# Altium schematic sheet Upper_Board.SchDoc
size A3
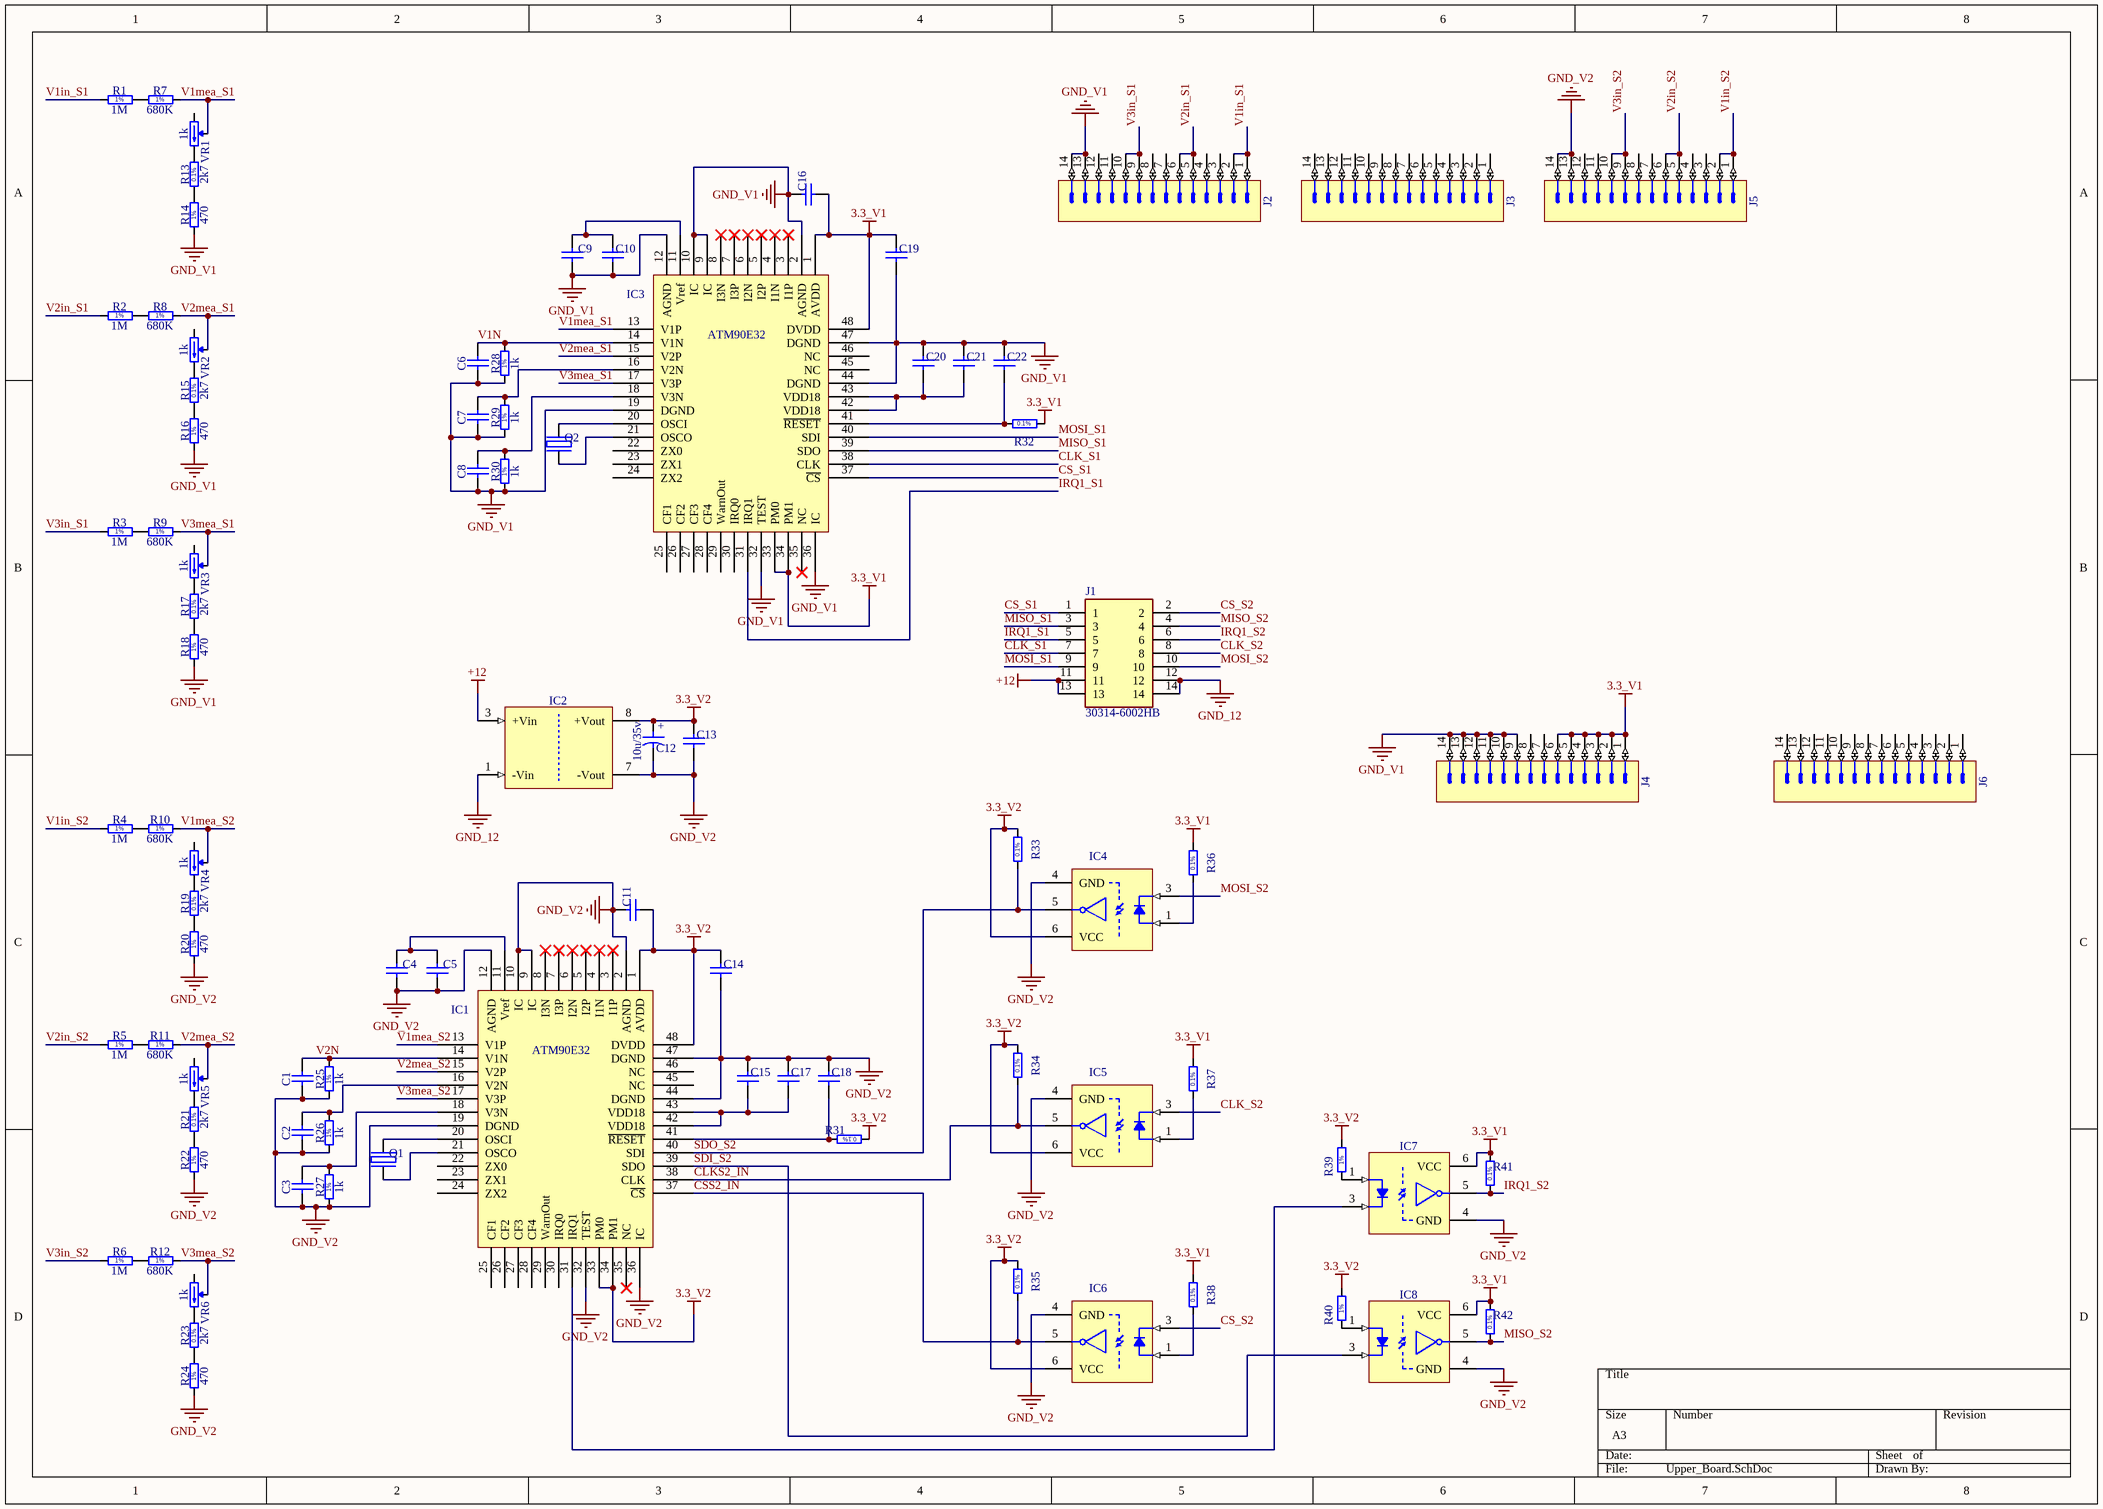
[diagram p0: Upper_Board.SchDoc]

## Parts
C1  18nf  [CAPC2012X135N]  (value not drawn)
C2  18nf  [CAPC2012X135N]  (value not drawn)
C3  18nf  [CAPC2012X135N]  (value not drawn)
C4  0.1uf  [CAPC2012X135N]  (value not drawn)
C5  4.7uf  [CAPC2012X135N]  (value not drawn)
C6  18nf  [CAPC2012X135N]  (value not drawn)
C7  18nf  [CAPC2012X135N]  (value not drawn)
C8  18nf  [CAPC2012X135N]  (value not drawn)
C9  0.1uf  [CAPC2012X135N]  (value not drawn)
C10  4.7uf  [CAPC2012X135N]  (value not drawn)
C11  0.1uf  [CAPC2012X135N]  (value not drawn)
C12  10u/35v  [CAPAE530X540N]
C13  0.1uf  [CAPC2012X135N]  (value not drawn)
C14  0.1uf  [CAPC2012X135N]  (value not drawn)
C15  0.1uf  [CAPC2012X135N]  (value not drawn)
C16  0.1uf  [CAPC2012X135N]  (value not drawn)
C17  10uf  [CAPC2012X135N]  (value not drawn)
C18  0.1uf  [CAPC2012X135N]  (value not drawn)
C19  0.1uf  [CAPC2012X135N]  (value not drawn)
C20  0.1uf  [CAPC2012X135N]  (value not drawn)
C21  10uf  [CAPC2012X135N]  (value not drawn)
C22  0.1uf  [CAPC2012X135N]  (value not drawn)
IC1  ATM90E32  [LQFP48_N]
IC2  TES 1-0511  [DCDC_TRACO_TES1-XX1X]  (value not drawn)
IC3  ATM90E32  [LQFP48_N]
IC4  ACPL-W60L-000E  [SOIC127P1150X360-6N]  (value not drawn)
IC5  ACPL-W60L-000E  [SOIC127P1150X360-6N]  (value not drawn)
IC6  ACPL-W60L-000E  [SOIC127P1150X360-6N]  (value not drawn)
IC7  ACPL-W60L-000E  [SOIC127P1150X360-6N]  (value not drawn)
IC8  ACPL-W60L-000E  [SOIC127P1150X360-6N]  (value not drawn)
J1  30314-6002HB  [SHDR14W64P254_2X7_2540X878X955P]
J2  Header 14  [STELVIO-KONTEK_3910401114400]  (value not drawn)
J3  Header 14  [STELVIO-KONTEK_3910401114400]  (value not drawn)
J4  Header 14  [STELVIO-KONTEK_3910401114400]  (value not drawn)
J5  Header 14  [STELVIO-KONTEK_3910401114400]  (value not drawn)
J6  Header 14  [STELVIO-KONTEK_3910401114400]  (value not drawn)
Q1  16.384Mhz  [XTAL1160X490X430]  (value not drawn)
Q2  16.384Mhz  [XTAL1160X490X430]  (value not drawn)
R1  1M  [RES1016-630X250]
R2  1M  [RES1016-630X250]
R3  1M  [RES1016-630X250]
R4  1M  [RES1016-630X250]
R5  1M  [RES1016-630X250]
R6  1M  [RES1016-630X250]
R7  680K  [RES1016-630X250]
R8  680K  [RES1016-630X250]
R9  680K  [RES1016-630X250]
R10  680K  [RES1016-630X250]
R11  680K  [RES1016-630X250]
R12  680K  [RES1016-630X250]
R13  2k7  [RESC2012X60N]
R14  470  [RESC2012X60N]
R15  2k7  [RESC2012X60N]
R16  470  [RESC2012X60N]
R17  2k7  [RESC2012X60N]
R18  470  [RESC2012X60N]
R19  2k7  [RESC2012X60N]
R20  470  [RESC2012X60N]
R21  2k7  [RESC2012X60N]
R22  470  [RESC2012X60N]
R23  2k7  [RESC2012X60N]
R24  470  [RESC2012X60N]
R25  1k  [RESC2012X60N]
R26  1k  [RESC2012X60N]
R27  1k  [RESC2012X60N]
R28  1k  [RESC2012X60N]
R29  1k  [RESC2012X60N]
R30  1k  [RESC2012X60N]
R31  10k  [RESC2012X60N]  (value not drawn)
R32  10k  [RESC2012X60N]  (value not drawn)
R33  10k  [RESC2012X60N]  (value not drawn)
R34  10k  [RESC2012X60N]  (value not drawn)
R35  10k  [RESC2012X60N]  (value not drawn)
R36  330  [RESC2012X60N]  (value not drawn)
R37  330  [RESC2012X60N]  (value not drawn)
R38  330  [RESC2012X60N]  (value not drawn)
R39  330  [RESC2012X60N]  (value not drawn)
R40  330  [RESC2012X60N]  (value not drawn)
R41  10k  [RESC2012X60N]  (value not drawn)
R42  10k  [RESC2012X60N]  (value not drawn)
VR1  1k  [VR5]
VR2  1k  [VR5]
VR3  1k  [VR5]
VR4  1k  [VR5]
VR5  1k  [VR5]
VR6  1k  [VR5]

## Nets
3.3_V1: C16.2 C19.1 IC3.1(AVDD) IC3.33(PM0) IC3.34(PM1) IC3.48(DVDD) IC7.6(VCC) IC8.6(VCC) J4.1 J4.2 J4.3 J4.4 J4.5 J4.6 R32.2 R36.2 R37.2 R38.2 R41.2 R42.2
3.3_V2: C11.2 C12.1 C13.1 C14.1 IC1.1(AVDD) IC1.33(PM0) IC1.34(PM1) IC1.48(DVDD) IC2.8(+Vout) IC4.6(VCC) IC5.6(VCC) IC6.6(VCC) R31.1 R33.2 R34.2 R35.2 R39.2 R40.2
+12: IC2.3(+Vin) J1.11 J1.13
GND_12: IC2.1(-Vin) J1.12 J1.14
GND_V1: C6.1 C7.1 C8.1 C9.2 C10.1 C16.1 C19.2 C20.1 C21.2 C22.1 IC3.2(AGND) IC3.9(IC) IC3.10(IC) IC3.12(AGND) IC3.19(DGND) IC3.32(TEST) IC3.36(IC) IC3.44(DGND) IC3.47(DGND) J2.13 J2.14 J4.9 J4.10 J4.11 J4.12 J4.13 J4.14 R14.1 R16.1 R18.1 R28.1 R29.1 R30.1
GND_V2: C1.1 C2.1 C3.1 C4.2 C5.1 C11.1 C12.2 C13.2 C14.2 C15.1 C17.2 C18.1 IC1.2(AGND) IC1.9(IC) IC1.10(IC) IC1.12(AGND) IC1.19(DGND) IC1.32(TEST) IC1.36(IC) IC1.44(DGND) IC1.47(DGND) IC2.7(-Vout) IC4.4(GND) IC5.4(GND) IC6.4(GND) IC7.4(GND) IC8.4(GND) J5.13 J5.14 R20.1 R22.1 R24.1 R25.1 R26.1 R27.1
CLK_S1: IC3.38(CLK) J1.7
CLK_S2: IC5.3(K) J1.8
CLKS2_IN: IC1.38(CLK) IC5.5(VO) R34.1
CS_S1: IC3.37(~{CS}) J1.1
CS_S2: IC6.3(K) J1.2
CSS2_IN: IC1.37(~{CS}) IC6.5(VO) R35.1
IRQ1_S1: IC3.31(IRQ1) J1.5
IRQ1_S2: IC7.5(VO) J1.6 R41.1
MISO_S1: IC3.39(SDO) J1.3
MISO_S2: IC8.5(VO) J1.4 R42.1
MOSI_S1: IC3.40(SDI) J1.9
MOSI_S2: IC4.3(K) J1.10
SDI_S2: IC1.39(SDO) IC8.3(K)
SDO_S2: IC1.40(SDI) IC4.5(VO) R33.1
V1in_S1: J2.1 J2.2 R1.1
V1in_S2: J5.1 J5.2 R4.1
V1mea_S1: IC3.13(V1P) R7.2 VR1.2(W)
V1mea_S2: IC1.13(V1P) R10.2 VR4.2(W)
V1N: C6.2 IC3.14(V1N) R28.2
V2in_S1: J2.5 J2.6 R2.1
V2in_S2: J5.5 J5.6 R5.1
V2mea_S1: IC3.15(V2P) R8.2 VR2.2(W)
V2mea_S2: IC1.15(V2P) R11.2 VR5.2(W)
V2N: C1.2 IC1.14(V1N) R25.2
V3in_S1: J2.9 J2.10 R3.1
V3in_S2: J5.9 J5.10 R6.1
V3mea_S1: IC3.17(V3P) R9.2 VR3.2(W)
V3mea_S2: IC1.17(V3P) R12.2 VR6.2(W)
NetC2_2: C2.2 IC1.16(V2N) R26.2
NetC3_2: C3.2 IC1.18(V3N) R27.2
NetC4_1: C4.1 C5.2 IC1.11(Vref)
NetC7_2: C7.2 IC3.16(V2N) R29.2
NetC8_2: C8.2 IC3.18(V3N) R30.2
NetC9_1: C9.1 C10.2 IC3.11(Vref)
NetC15_2: C15.2 C17.1 IC1.42(VDD18) IC1.43(VDD18)
NetC18_2: C18.2 IC1.41(~{RESET}) R31.2
NetC20_2: C20.2 C21.1 IC3.42(VDD18) IC3.43(VDD18)
NetC22_2: C22.2 IC3.41(~{RESET}) R32.1
NetIC1_20: IC1.20(OSCI) Q1.1(OSC1)
NetIC1_21: IC1.21(OSCO) Q1.2(OSC2)
NetIC1_31: IC1.31(IRQ1) IC7.3(K)
NetIC3_20: IC3.20(OSCI) Q2.1(OSC1)
NetIC3_21: IC3.21(OSCO) Q2.2(OSC2)
NetIC4_1: IC4.1(A) R36.1
NetIC5_1: IC5.1(A) R37.1
NetIC6_1: IC6.1(A) R38.1
NetIC7_1: IC7.1(A) R39.1
NetIC8_1: IC8.1(A) R40.1
NetR1_2: R1.2 R7.1
NetR2_2: R2.2 R8.1
NetR3_2: R3.2 R9.1
NetR4_2: R4.2 R10.1
NetR5_2: R5.2 R11.1
NetR6_2: R6.2 R12.1
NetR13_1: R13.1 R14.2
NetR13_2: R13.2 VR1.3(CW)
NetR15_1: R15.1 R16.2
NetR15_2: R15.2 VR2.3(CW)
NetR17_1: R17.1 R18.2
NetR17_2: R17.2 VR3.3(CW)
NetR19_1: R19.1 R20.2
NetR19_2: R19.2 VR4.3(CW)
NetR21_1: R21.1 R22.2
NetR21_2: R21.2 VR5.3(CW)
NetR23_1: R23.1 R24.2
NetR23_2: R23.2 VR6.3(CW)

Not connected (* = marked no-connect by the designer): IC1 3(I1P)* 4(I1N)* 5(I2P)* 6(I2N)* 7(I3P)* 8(I3N)* 22(ZX0) 23(ZX1) 24(ZX2) 25(CF1) 26(CF2) 27(CF3) 28(CF4) 29(WarnOut) 30(IRQ0) 35(NC)* 45(NC) 46(NC); IC3 3(I1P)* 4(I1N)* 5(I2P)* 6(I2N)* 7(I3P)* 8(I3N)* 22(ZX0) 23(ZX1) 24(ZX2) 25(CF1) 26(CF2) 27(CF3) 28(CF4) 29(WarnOut) 30(IRQ0) 35(NC)* 45(NC) 46(NC); J2 3 4 7 8 11 12; J3 1 2 3 4 5 6 7 8 9 10 11 12 13 14; J4 7 8; J5 3 4 7 8 11 12; J6 1 2 3 4 5 6 7 8 9 10 11 12 13 14; VR1 1(CCW); VR2 1(CCW); VR3 1(CCW); VR4 1(CCW); VR5 1(CCW); VR6 1(CCW)

## Notes on the sheet
- (in symbol CAE530-540_10UF_35V_20%) +
- (in symbol R0805_1K_1%_0.125W_100PPM) 1%
- (in symbol R0805_2K7_0.1%_0.125W_25PPM) 0.1%
- (in symbol R0805_10K_0.1%_0.1W_10PPM) 0.1%
- (in symbol R0805_330R_1%_0.125W_100PPM) 1%
- (in symbol R0805_470R_1%_0.125W_100PPM) 1%
- (in symbol RMF_1M_1%_0.6W_50PPM_1016-630X250) 1%
- (in symbol RMF_680K_1%_0.6W_50PPM_1016-630X250) 1%

## Library data of the parts
C1-C3 C6-C8 = CC0805_18NF_50V_10%_X7R: 0328-0120-2; Part Description: SMD Multilayer Chip Ceramic Capacitor; Manufacturer: GENERIC; Manufacturer1 Part Number: 223858615639; Voltage: 50V; TC: X7R; Tolerance: ±10%; Table: Capacitors SMD; Part Number: CC0805_18NF_50V_10%_X7R; Component Kind: Standard; Component Type: Standard; Pin Count: 2; Value: 18nF; Status: Preferred; Manufacturer Part Number: CC0805_18NF_50V_10%_X7R; Case: 0805; Mounted: Yes; Socket: No; SMD: Yes; Manufacturer1 Example: PHYCOMP; Manufacturer1 ComponentHeight: 1.35mm; HelpURL: \\cern.ch\dfs\Applications\Altium\Datasheets\CC0805_X7R_PHYCOMP.pdf; Author: CERN DEM JLC; CreateDate: 3/12/2550; LatestRevisionDate: 3/12/2550
C4 C9 C11 C13-C16 C18-C20 C22 = CC0805_100NF_50V_10%_X7R: 0092-0004-8; Part Description: SMD Multilayer Chip Ceramic Capacitor; Manufacturer: GENERIC; Manufacturer1 Part Number: B37941K5104K62; Value: 100nF; Voltage: 50V; TC: X7R; Tolerance: ±10%; Table: Capacitors SMD; Part Number: CC0805_100NF_50V_10%_X7R; Component Kind: Standard; Component Type: Standard; Pin Count: 2; Status: Preferred; Manufacturer Part Number: CC0805_100NF_50V_10%_X7R; Case: 0805; Mounted: Yes; Socket: No; SMD: Yes; Manufacturer1 Example: EPCOS; Manufacturer1 ComponentHeight: 1.35mm; HelpURL: \\cern.ch\dfs\Applications\Altium\Datasheets\CC0805_X7R_EPCOS.pdf; Author: CERN DEM JLC; CreateDate: 3/12/2550; LatestRevisionDate: 3/12/2550
C5 C10 = CC0805_4.7UF_10V_10%_X5R: 0160-0457-5; Part Description: SMD Multilayer Chip Ceramic Capacitor; Manufacturer: GENERIC; Manufacturer1 Part Number: 222224013672; Voltage: 10V; TC: X5R; Tolerance: ±10%; Table: Capacitors SMD; Part Number: CC0805_4.7UF_10V_10%_X5R; Component Kind: Standard; Component Type: Standard; Pin Count: 2; Value: 4.7uF; Status: Preferred; Manufacturer Part Number: CC0805_4.7UF_10V_10%_X5R; Case: 0805; Mounted: Yes; Socket: No; SMD: Yes; Manufacturer1 Example: PHYCOMP; Manufacturer1 ComponentHeight: 1.45mm; HelpURL: \\cern.ch\dfs\Applications\Altium\Datasheets\CC0805_X5R_PHYCOMP_HC.pdf; Author: CERN DEM JLC; CreateDate: 3/12/2550; LatestRevisionDate: 3/12/2550
C12 = CAE530-540_10UF_35V_20%: 0289-0032-3; Part Description: Aluminum Electrolytic SMT Capacitor; Manufacturer: GENERIC; Manufacturer1 Part Number: EEEFK1V100AR; Value: 10uF; Voltage: 35V; Tolerance: ±20%; Table: Capacitors SMD; Part Number: CAE530-540_10UF_35V_20%; Component Kind: Standard; Component Type: Standard; Pin Count: 2; Status: Not Recommended; Manufacturer Part Number: CAE530-540_10UF_35V_20%; Case: C; Mounted: Yes; Socket: No; SMD: Yes; Manufacturer1 Example: PANASONIC; Manufacturer1 ComponentHeight: 5.8mm; HelpURL: \\cern.ch\dfs\Applications\Altium\Datasheets\CAE_PANASONIC_FK.pdf; Author: CERN DEM JLC; CreateDate: 3/12/2550; LatestRevisionDate: 3/12/2550
C17 C21 = CC0805_10UF_10V_10%_X7R: 0328-0108-8; Part Description: SMD Multilayer Chip Ceramic Capacitor; Manufacturer: GENERIC; Manufacturer1 Part Number: GRM21BR71A106KE51L; Voltage: 10V; TC: X7R; Tolerance: ±10%; Table: Capacitors SMD; Part Number: CC0805_10UF_10V_10%_X7R; Component Kind: Standard; Component Type: Standard; Pin Count: 2; Value: 10uF; Status: Preferred; Manufacturer Part Number: CC0805_10UF_10V_10%_X7R; Case: 0805; Mounted: Yes; Socket: No; SMD: Yes; Manufacturer1 Example: MURATA; Manufacturer1 ComponentHeight: 1.35mm; HelpURL: \\cern.ch\dfs\Applications\Altium\Datasheets\CC0805_X7R_MURATA.pdf; Author: CERN DEM JLC; CreateDate: 30/4/2555; LatestRevisionDate: 30/4/2555
IC2 = TES 1-0511: 0658-0041-5 DC-DC Converter 3.3VDC/30mA-303mA,1W, / Isolated and Unregulated Single Output, / Fixed Input Voltage 12VDC; Part Description: 5V ±10% to 5V, Iout (max) 200mA, 1W DC-DC Converter; Manufacturer: TRACO POWER; Table: DC-DC Converters; Part Number: TES 1-0511; Component Kind: Standard; Component Type: Standard; Device: TES 1-0511; PackageDescription: TES 1 Series, Single Output DC/DC Converter,  Body 13.7x8mm; Manufacturer Part Number: TES 1-0511; Pin Count: 5; Mounted: Yes; Socket: No; SMD: Yes; ComponentHeight: 7.25mm; HelpURL: \\cern.ch\dfs\Applications\Altium\Datasheets\TES 1-0511.pdf; Author: CERN DEM JMW; CreateDate: 13/1/2554; LatestRevisionDate: 13/1/2554
IC4-IC8 = ACPL-W60L-000E: 0087-0267-8; Part Description: High Speed LVTTL Compatible 3.3Volt/5Volt Optocoupler; Manufacturer: AVAGO TECHNOLOGIES; Table: Optocouplers; Part Number: ACPL-W60L-000E; Component Kind: Standard; Component Type: Standard; Device: ACPL-W60L-000E; PackageDescription: SOIC, 1.27mm Pitch; 6 Pin, 6.90mm W X 4.70mm L X 3.60mm H Body, IPC Medium Density; Manufacturer Part Number: ACPL-W60L-000E; Pin Count: 6; Case: SOIC6; Mounted: Yes; Socket: No; SMD: Yes; ComponentHeight: 3.6mm; HelpURL: \\cern.ch\dfs\Applications\Altium\Datasheets\ACPL-W60L-000E.pdf; Author: CERN DEM JMW; CreateDate: 26/2/2557; LatestRevisionDate: 26/2/2557
J1 = 30314-6002HB: Connector; Manufacturer_Name: 3M; Datasheet Link: https://componentsearchengine.com/Datasheets/2/30314-6002HB.pdf; Height: 9.554mm; Manufacturer_Part_Number: 30314-6002HB
J2-J6 = STELVIO-KONTEK_3910401114400: Connector 14 Male; Part Description: 14 Contacts - Pitch 2.54mm - Dual Row Right Angle Strip Header - Insulator 1.7mm; Table: STELVIO-KONTEK COMATEL; Part Number: STELVIO-KONTEK_3910401114400; Component Kind: Standard; Component Type: Standard; Pin Count: 14; Family: Header 14; Mounted: Yes; Socket: No; SMD: No; Status: None; Manufacturer: STELVIO-KONTEK; Manufacturer Part Number: 3910401114400; ComponentHeight: 5.7mm; HelpURL: \\cern.ch\dfs\Applications\Altium\Datasheets\STELVIO-KONTEK_3910401114400.pdf; Author: CERN DEM JLC; CreateDate: 29/8/2556; LatestRevisionDate: 29/8/2556
Q1 Q2 = XTAL_6MHZ_RAKON_HC49/4H SMX_20/50/10/16: 0099-0185-7; Part Description: Tolerance:± 20ppm, Stability:± 50ppm, -10°C to +70°C, 16pF, Surface Mount Quartz Crystal, HC49/4HSMX Serie; Manufacturer: RAKON; Manufacturer Part Number: 6MHz HC49/4H SMX 20/50/10/16; Value: 6MHz; Table: Crystals & Oscillators; Part Number: XTAL_6MHZ_RAKON_HC49/4H SMX_20/50/10/16; Component Kind: Standard; Component Type: Standard; PackageDescription: HC49/4H SMX Case, SMD Cristal, Body 11.6x4.9mm; Pin Count: 2; Mounted: Yes; Socket: No; SMD: Yes; ComponentHeight: 4.3mm; HelpURL: \\cern.ch\dfs\Applications\Altium\Datasheets\XTAL_RAKON_HC49-4HSMX.pdf; Author: CERN DEM JMW; CreateDate: 7/10/2551; LatestRevisionDate: 3/6/2553
R1-R6 = RMF_1M_1%_0.6W_50PPM_1016-630X250: 0150-2831-6; Part Description: Leaded Metal Film Resistor; Manufacturer: GENERIC; Manufacturer1 Part Number: MBB02070C1004FCT00; Power: 0.6W; TC: ±50ppm/°C; Tolerance: ±1%; Table: Resistors THD; Part Number: RMF_1M_1%_0.6W_50PPM_1016-630X250; Component Kind: Standard; Component Type: Standard; Pin Count: 2; Value: 1M; Status: Preferred; Manufacturer Part Number: RMF_1M_1%_0.6W_50PPM_1016-630X250; Case: LS10.16 L6.3 x D2.5; Mounted: Yes; Socket: No; SMD: No; ComponentHeight: 2.5mm; Manufacturer1 Example: VISHAY BEYSCHLAG; Manufacturer1 ComponentHeight: 2.5mm; HelpURL: \\cern.ch\dfs\Applications\Altium\Datasheets\RMF_VISHAY_MBB0207.pdf; Author: CERN DEM JLC; CreateDate: 4/12/2550; LatestRevisionDate: 7/4/2551
R7-R12 = RMF_680K_1%_0.6W_50PPM_1016-630X250: 0150-0219-0; Part Description: Leaded Metal Film Resistor; Manufacturer: GENERIC; Manufacturer1 Part Number: MBB02070C6803FCT00; Power: 0.6W; TC: ±50ppm/°C; Tolerance: ±1%; Table: Resistors THD; Part Number: RMF_680K_1%_0.6W_50PPM_1016-630X250; Component Kind: Standard; Component Type: Standard; Pin Count: 2; Value: 680k; Status: Preferred; Manufacturer Part Number: RMF_680K_1%_0.6W_50PPM_1016-630X250; Case: LS10.16 L6.3 x D2.5; Mounted: Yes; Socket: No; SMD: No; ComponentHeight: 2.5mm; Manufacturer1 Example: VISHAY BEYSCHLAG; Manufacturer1 ComponentHeight: 2.5mm; HelpURL: \\cern.ch\dfs\Applications\Altium\Datasheets\RMF_VISHAY_MBB0207.pdf; Author: CERN DEM JLC; CreateDate: 4/12/2550; LatestRevisionDate: 7/4/2551
R13 R15 R17 R19 R21 R23 = R0805_2K7_0.1%_0.125W_25PPM: 0150-3998-7; Part Description: Thin Film Chip Resistor; Manufacturer: GENERIC; Manufacturer1 Part Number: ERA6AEB272V; Power: 0.125W; TC: ±25ppm; Tolerance: ±0.1%; Table: Resistors SMD; Part Number: R0805_2K7_0.1%_0.125W_25PPM; Component Kind: Standard; Component Type: Standard; Pin Count: 2; Value: 2k7; Status: Not recommended; Manufacturer Part Number: R0805_2K7_0.1%_0.125W_25PPM; Case: 0805; Mounted: Yes; Socket: No; SMD: Yes; Manufacturer1 Example: PANASONIC; Manufacturer1 ComponentHeight: 0.6mm; HelpURL: \\cern.ch\dfs\Applications\Altium\Datasheets\R0805_PANASONIC_ERA.pdf; Author: CERN DEM JLC; CreateDate: 25/10/2554; LatestRevisionDate: 25/10/2554
R14 R16 R18 R20 R22 R24 = R0805_470R_1%_0.125W_100PPM: 0150-1892-7; Part Description: General Purpose Thick Film Chip Resistor; Manufacturer: GENERIC; Manufacturer1 Part Number: NRC10F4700TRF; Power: 0.125W; TC: ±100ppm/°C; Tolerance: ±1%; Table: Resistors SMD; Part Number: R0805_470R_1%_0.125W_100PPM; Component Kind: Standard; Component Type: Standard; Pin Count: 2; Value: 470; Status: Preferred; Manufacturer Part Number: R0805_470R_1%_0.125W_100PPM; Case: 0805; Mounted: Yes; Socket: No; SMD: Yes; Manufacturer1 Example: NIC COMPONENT; Manufacturer1 ComponentHeight: 0.6mm; HelpURL: \\cern.ch\dfs\Applications\Altium\Datasheets\R0805_NIC_NRC.pdf; Author: CERN DEM JLC; CreateDate: 3/12/2550; LatestRevisionDate: 13/3/2551
R25-R30 = R0805_1K_1%_0.125W_100PPM: 0176-0313-5; Part Description: General Purpose Thick Film Chip Resistor; Manufacturer: GENERIC; Manufacturer1 Part Number: NRC10F1001TRF; Power: 0.125W; TC: ±100ppm/°C; Tolerance: ±1%; Table: Resistors SMD; Part Number: R0805_1K_1%_0.125W_100PPM; Component Kind: Standard; Component Type: Standard; Pin Count: 2; Value: 1k; Status: Preferred; Manufacturer Part Number: R0805_1K_1%_0.125W_100PPM; Case: 0805; Mounted: Yes; Socket: No; SMD: Yes; Manufacturer1 Example: NIC COMPONENT; Manufacturer1 ComponentHeight: 0.6mm; HelpURL: \\cern.ch\dfs\Applications\Altium\Datasheets\R0805_NIC_NRC.pdf; Author: CERN DEM JLC; CreateDate: 3/12/2550; LatestRevisionDate: 13/3/2551
R31-R35 R41 R42 = R0805_10K_0.1%_0.1W_10PPM: 0176-0426-3; Part Description: Thin Film Chip Resistor; Manufacturer: GENERIC; Manufacturer1 Part Number: RN73C2A10KBTG; Power: 0.1W; TC: ±10ppm; Tolerance: ±0.1%; Table: Resistors SMD; Part Number: R0805_10K_0.1%_0.1W_10PPM; Component Kind: Standard; Component Type: Standard; Pin Count: 2; Value: 10k; Status: Not recommended; Manufacturer Part Number: R0805_10K_0.1%_0.1W_10PPM; Case: 0805; Mounted: Yes; Socket: No; SMD: Yes; Manufacturer1 Example: TYCO HOLSWORTHY; Manufacturer1 ComponentHeight: 0.6mm; HelpURL: \\cern.ch\dfs\Applications\Altium\Datasheets\R0805_Tyco_RN73.pdf; Author: CERN DEM JLC; CreateDate: 3/12/2550; LatestRevisionDate: 13/3/2551
R36-R38 = R0805_10K_0.1%_0.1W_10PPM: 0150-3297-4; Part Description: Thin Film Chip Resistor; Manufacturer: GENERIC; Manufacturer1 Part Number: RN73C2A10KBTG; Value: 10k; Power: 0.1W; TC: ±10ppm; Tolerance: ±0.1%; Table: Resistors SMD; Part Number: R0805_10K_0.1%_0.1W_10PPM; Component Kind: Standard; Component Type: Standard; Pin Count: 2; Status: Not recommended; Manufacturer Part Number: R0805_10K_0.1%_0.1W_10PPM; Case: 0805; Mounted: Yes; Socket: No; SMD: Yes; Manufacturer1 Example: TYCO HOLSWORTHY; Manufacturer1 ComponentHeight: 0.6mm; HelpURL: \\cern.ch\dfs\Applications\Altium\Datasheets\R0805_Tyco_RN73.pdf; Author: CERN DEM JLC; CreateDate: 3/12/2550; LatestRevisionDate: 13/3/2551
R39 R40 = R0805_330R_1%_0.125W_100PPM: 0150-3297-4; Part Description: General Purpose Thick Film Chip Resistor; Manufacturer: GENERIC; Manufacturer1 Part Number: NRC10F3300TRF; Power: 0.125W; TC: ±100ppm/°C; Tolerance: ±1%; Table: Resistors SMD; Part Number: R0805_330R_1%_0.125W_100PPM; Component Kind: Standard; Component Type: Standard; Pin Count: 2; Value: 330; Status: Preferred; Manufacturer Part Number: R0805_330R_1%_0.125W_100PPM; Case: 0805; Mounted: Yes; Socket: No; SMD: Yes; Manufacturer1 Example: NIC COMPONENT; Manufacturer1 ComponentHeight: 0.6mm; HelpURL: \\cern.ch\dfs\Applications\Altium\Datasheets\R0805_NIC_NRC.pdf; Author: CERN DEM JLC; CreateDate: 3/12/2550; LatestRevisionDate: 13/3/2551
VR1-VR6 = TRIM_12T_100K_BOURNS_3266W-1-104LF: 0141-0164-9; Part Description: 12 Turn Trimming Potentiometer (Top Adjustement); Manufacturer: BOURNS; Value: 100k; Power: 0.25W; TC: ?100ppm/?C; Tolerance: ?10%; Table: Potentiometers THD; Part Number: TRIM_12T_100K_BOURNS_3266W-1-104LF; Component Kind: Standard; Component Type: Standard; Footprint: TRIM_BOURNS_3266W; Pin Count: 3; Manufacturer Part Number: 3266W-1-104LF; Case: 3266W; Mounted: Yes; Socket: No; SMD: No; ComponentHeight: 7.75mm; HelpURL: \\cern.ch\dfs\Applications\Altium\Datasheets\TRIM_BOURNS_3266W.pdf; Author: CERN DEM JLC; CreateDate: 10/6/2551; LatestRevisionDate: 28/11/2555